# EAGLE design SharkBait_328 (EAGLE 7.1.0)
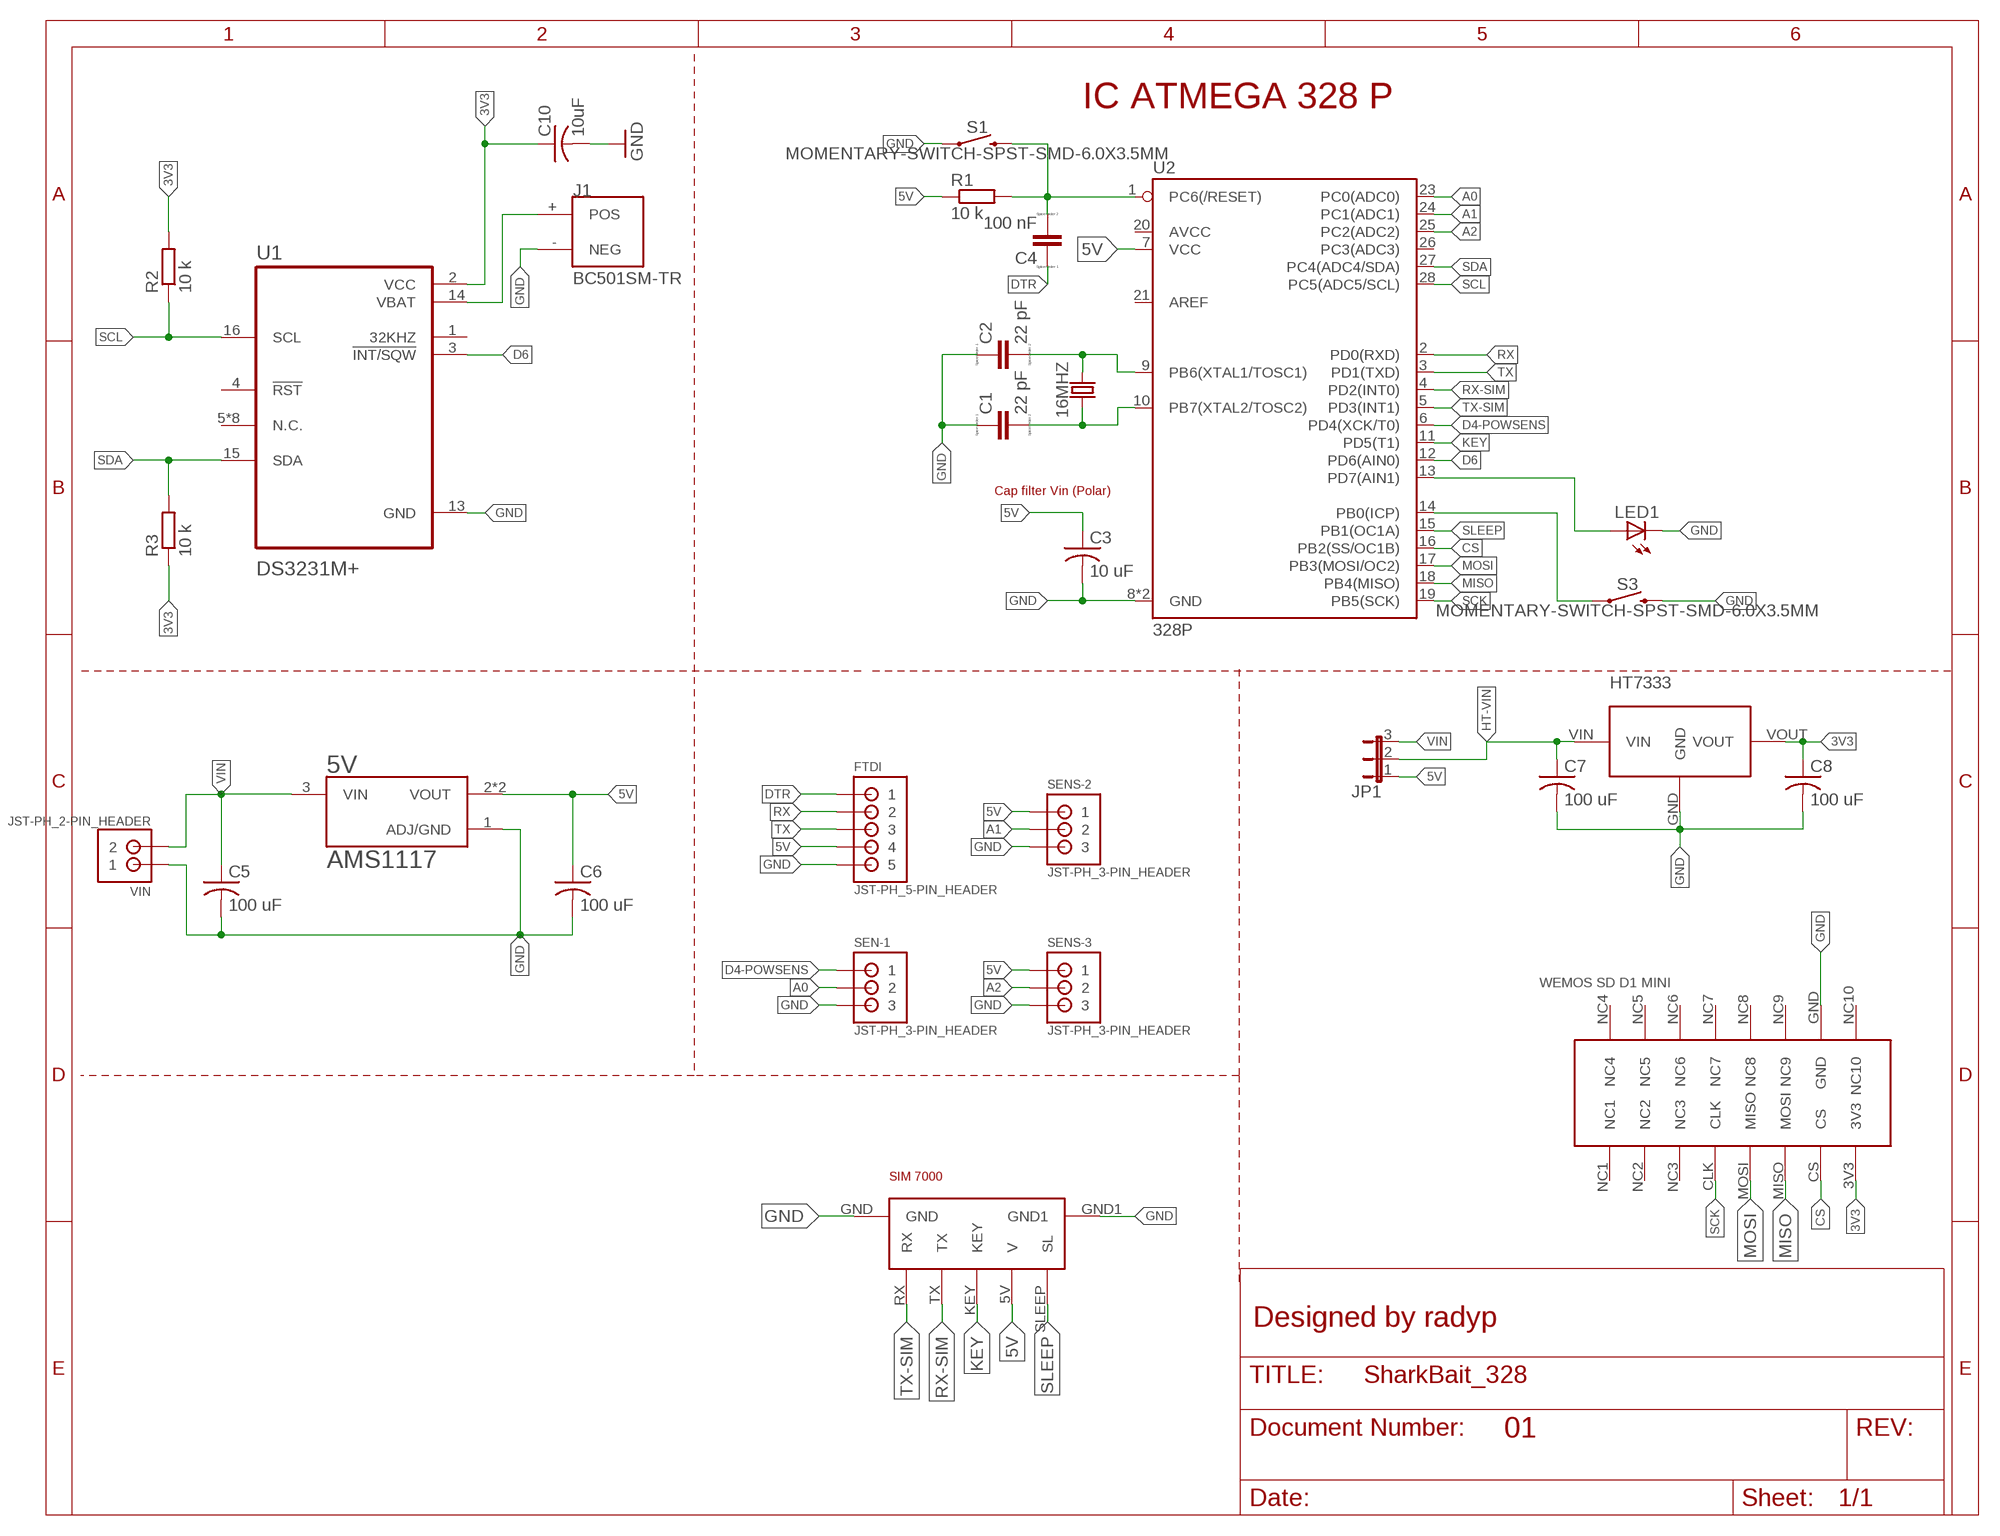
[diagram p0: schematic, sheet 1]

## Parts
5V  AMS1117  [SOT229P700X180-4N]
16MHZ  CRYSTALPTH-HC49US  [HC49US]
C1  22 pF  C  [C0805]
C2  22 pF  C  [C0805]
C3  10 uF  C-USC1206  [C1206]
C4  100 nF  C  [C0805]
C5  100 uF  C-USC1206  [C1206]
C6  100 uF  C-USC1206  [C1206]
C7  100 uF  C-USC1206  [C1206]
C8  100 uF  C-USC1206  [C1206]
C10  10uF  CAPACITOR-SMD-0805  [SMD-0805]
FTDI  JST-PH_5-PIN_HEADER  [JST_B5B-PH_HEADER]
HT7333  HT7333  [SOT89]
J1  BC501SM-TR  [MPD_BC501SM-TR]
JP1  JP2E  [JP2]
LED1  LEDCHIP-LED0805  [CHIP-LED0805]
R1  10 k  R-EU_M0805  [M0805]
R2  10 k  R-EU_M0805  [M0805]
R3  10 k  R-EU_M0805  [M0805]
S1  MOMENTARY-SWITCH-SPST-SMD-6.0X3.5MM  [TACTILE_SWITCH_SMD_6.0X3.5MM]
S3  MOMENTARY-SWITCH-SPST-SMD-6.0X3.5MM  [TACTILE_SWITCH_SMD_6.0X3.5MM]
SEN-1  JST-PH_3-PIN_HEADER  [JST_B3B-PH_HEADER]
SENS-2  JST-PH_3-PIN_HEADER  [JST_B3B-PH_HEADER]
SENS-3  JST-PH_3-PIN_HEADER  [JST_B3B-PH_HEADER]
U1  DS3231M+  [SOIC127P1032X265-16N]
U2  328P  ATMEGA328P_PDIP  [DIP28]
U$1  WEMOS_SD_D1_MINI  [WEMOS_SD_D1_MINI]
U$2  SIM7000  [SIM_7000]
VIN  JST-PH_2-PIN_HEADER  [JST_B2B-PH_HEADER]

## Nets
3V3: C8.1 C10.1 HT7333.VOUT R2.2 R3.1 U1.2(VCC) U$1.3V3
5V: 5V.2(VOUT) 5V.4(VOUT) C3.1 C6.1 FTDI.P4 JP1.1 R1.1 SENS-2.P1 SENS-3.P1 U2.7(VCC) U$2.5V(V)
A0: SEN-1.P2 U2.23(PC0(ADC0))
A1: SENS-2.P2 U2.24(PC1(ADC1))
A2: SENS-3.P2 U2.25(PC2(ADC2))
CS: U2.16(PB2(SS/OC1B)) U$1.CS
D4-POWSENS: SEN-1.P1 U2.6(PD4(XCK/T0))
D6: U1.3(!INT/SQW) U2.12(PD6(AIN0))
DTR: C4.1 FTDI.P1
GND: 5V.1(ADJ/GND) C1.1 C2.1 C3.2 C5.2 C6.2 C7.2 C8.2 C10.2 FTDI.P5 HT7333.GND J1.-(NEG) LED1.C S1.1 S3.2 SEN-1.P3 SENS-2.P3 SENS-3.P3 U1.13(GND) U2.8(GND) U2.22(GND) U$1.GND U$2.GND U$2.GND1 VIN.P1
HT-VIN: C7.1 HT7333.VIN JP1.2
KEY: U2.11(PD5(T1)) U$2.KEY
MISO: U2.18(PB4(MISO)) U$1.MISO(MOSI)
MOSI: U2.17(PB3(MOSI/OC2)) U$1.MOSI(MISO)
N$1: 16MHZ.2 C2.2 U2.9(PB6(XTAL1/TOSC1))
N$2: 16MHZ.1 C1.2 U2.10(PB7(XTAL2/TOSC2))
N$4: J1.+(POS) U1.14(VBAT)
N$5: LED1.A U2.13(PD7(AIN1))
N$8: S3.1 U2.14(PB0(ICP))
N$10: C4.2 R1.2 S1.2 U2.1(PC6(/RESET))
RX: FTDI.P2 U2.2(PD0(RXD))
RX-SIM: U2.4(PD2(INT0)) U$2.TX
SCK: U2.19(PB5(SCK)) U$1.CLK
SCL: R2.1 U1.16(SCL) U2.28(PC5(ADC5/SCL))
SDA: R3.2 U1.15(SDA) U2.27(PC4(ADC4/SDA))
SLEEP: U2.15(PB1(OC1A)) U$2.SLEEP(SL)
TX: FTDI.P3 U2.3(PD1(TXD))
TX-SIM: U2.5(PD3(INT1)) U$2.RX
VIN: 5V.3(VIN) C5.1 JP1.3 VIN.P2
Unconnected: U1.1(32KHZ) U1.4(!RST) U1.5(N.C.) U1.6(N.C.) U1.7(N.C.) U1.8(N.C.) U1.9(N.C.) U1.10(N.C.) U1.11(N.C.) U1.12(N.C.) U2.20(AVCC) U2.21(AREF) U2.26(PC3(ADC3)) U$1.NC1 U$1.NC2 U$1.NC3 U$1.NC4 U$1.NC5 U$1.NC6 U$1.NC7 U$1.NC8 U$1.NC9 U$1.NC10

## Notes on the sheet
- IC ATMEGA 328 P
- Cap filter Vin (Polar)
- Designed by radyp
- 01

## Library data of the parts
5V = C_AMS1117:AMS1117: Sot223/Pkg 1-Amp 5-Volt Low Drop Out Voltage Regulatator; AVAILABILITY: Unavailable; DESCRIPTION: 1A LOW DROPOUT VOLTAGE REGULATOR; MF: Seeed Technology; MP: AMS1117; PACKAGE: SOT-223 Seeed Technology; PRICE: None
16MHZ = SparkFun-Clocks:CRYSTAL: Crystals (Generic) These are passive quartz crystals, which can be used as a clock source for a microcontroller. Crystal's are two-terminal devices. They require external "load" capacitors to generate an oscillating signal.
C1 C2 C4 = eagle-ltspice:C: CAPACITOR, European symbol; SPICEMODEL: NONE; SPICEPREFIX: C
C3 C5-C8 = adafruit:C-US: CAPACITOR, American symbol
C10 = Fuzzy:CAPACITOR-SMD-0805
FTDI = srg:JST-PH_5-PIN_HEADER: 5-pin JST PH Shrouded Header, top entry P/N B5B-PH-K-S Mating connector PHR-5 Mating cable assembly: Sparkfun PRT-09917 <http://www.sparkfun.com/products/9917>
HT7333 = C_HT7333_SOT89:HT7333
J1 = C_BC501SM-TR:BC501SM-TR: Holder Coin Cell For Cr1220 Smd; AVAILABILITY: Unavailable; DESCRIPTION: Holder Coin Cell For Cr1220 Smd; MF: MPD _Memory; MP: BC501SM-TR; PACKAGE: DFN-8 MPD; PRICE: None
JP1 = jumper:JP2E: JUMPER
LED1 = adafruit:LED: LED OSRAM: - CHIPLED LG R971, LG N971, LY N971, LG Q971, LY Q971, LO R971, LY R971 LH N974, LH R974 LS Q976, LO Q976, LY Q976 LO Q996 - Hyper CHIPLED LW Q18S LB Q993, LB Q99A, LB R99A - SideLED LS A670, LO A670, LY A670, LG A670, LP A670 LB A673, LV A673, LT A673, LW A673 LH A674 LY A675 LS A676, LA A676, LO A676, LY A676, LW A676 LS A679, LY A679, LG A679 - Hyper Micro SIDELED® LS Y876, LA Y876, LO Y876, LY Y876 LT Y87S - SmartLED LW L88C, LW L88S LB L89C, LB L89S, LG L890 LS L89K, LO L89K, LY L89K LS L896, LA L896, LO L896, LY L896 - TOPLED LS T670, LO T670, LY T670, LG T670, LP T670 LSG T670, LSP T670, LSY T670, LOP T670, LYG T670 LG T671, LOG T671, LSG T671 LB T673, LV T673, LT T673, LW T673 LH T674 LS T676, LA T676, LO T676, LY T676, LB T676, LH T676, LSB T676, LW T676 LB T67C, LV T67C, LT T67C, LS T67K, LO T67K, LY T67K, LW E67C LS E67B, LA E67B, LO E67B, LY E67B, LB E67C, LV E67C, LT E67C LW T67C LS T679, LY T679, LG T679 LS T770, LO T770, LY T770, LG T770, LP T770 LB T773, LV T773, LT T773, LW T773 LH T774 LS E675, LA E675, LY E675, LS T675 LS T776, LA T776, LO T776, LY T776, LB T776 LHGB T686 LT T68C, LB T68C - Hyper Mini TOPLED® LB M676 - Mini TOPLED Santana® LG M470 LS M47K, LO M47K, LY M47K Source: http://www.osram.convergy.de/
R1-R3 = resistor:R-EU_: RESISTOR, European symbol
S1 S3 = SparkFun-Switches:MOMENTARY-SWITCH-SPST: Momentary Switch (Pushbutton) - SPST Normally-open (NO) SPST momentary switches (buttons, pushbuttons). Variants PTH-12MM - 12mm square, through-hole Momentary Pushbutton Switch - 12mm Square <https://www.sparkfun.com/products/9190> (COM-09190) PTH-6.0MM, PTH-6.0MM-KIT - 6.0mm square, through-hole Mini Pushbutton Switch <https://www.sparkfun.com/products/97> (COM-00097) KIT package intended for soldering kit's - only one side of pads' copper is exposed. PTH-RIGHT-ANGLE-KIT - Right-angle, through-hole Right Angle Tactile Button <https://www.sparkfun.com/products/10791> - Used on SparkFun BigTime Watch Kit <https://www.sparkfun.com/products/11734> SMD-12MM - 12mm square, surface-mount Tactile Button - SMD (12mm) <https://www.sparkfun.com/products/12993> (COM-12993) Used on SparkFun PicoBoard <https://www.sparkfun.com/products/11888> SMD-4.5MM - 4.5mm Square Trackball Switch Used on SparkFun Blackberry Trackballer Breakout <https://www.sparkfun.com/products/13169> SMD-4.6MMX2.8MM - 4.60mm x 2.80mm, surface mount Used on SparkFun SAMD21 Mini Breakout <https://www.sparkfun.com/products/13664> SMD-5.2MM, SMD-5.2-REDUNDANT - 5.2mm square, surface-mount Mini Pushbutton Switch - SMD <https://www.sparkfun.com/products/8720> (COM-08720) Used on Arduino Pro Mini <https://www.sparkfun.com/products/11114> REDUNDANT package connects both switch circuits together SMD-6.0X3.5MM - 6.0 x 3.5mm, surface mount Momentary Reset Switch SMD <https://www.sparkfun.com/products/8229> (COM-08229) SMD-6.2MM-TALL - 6.2mm square, surface mount Tactile Button - SMD (6mm) <https://www.sparkfun.com/products/12992> Used on SparkFun Digital Sandbox <https://www.sparkfun.com/products/12651> SMD-RIGHT-ANGLE - Right-angle, surface mount Used on SparkFun Block for Intel® Edison - Arduino <https://www.sparkfun.com/products/13036>; PROD_ID: SWCH-00815; SF_SKU: COM-08229
SEN-1 SENS-2 SENS-3 = srg:JST-PH_3-PIN_HEADER: 3-pin JST PH Shrouded Header, top entry P/N B3B-PH-K-S Mating connector PHR-3
U1 = C_DS3231M_:DS3231M+; DESCRIPTION: Ic Real Time Clock I2c 16soic - Ds3231m+; DIGI-KEY_PART_NUMBER: DS3231M+-ND; DIGI-KEY_PURCHASE_URL: https://www.digikey.co.id/product-detail/en/maxim-integrated/DS3231M-/DS3231M--ND/2402420?utm_source=snapeda&utm_medium=aggregator&utm_campaign=symbol; MF: Maxim Integrated; MP: DS3231M+; PACKAGE: SOIC-16 Maxim
U2 = SparkFun-IC-Microcontroller:ATMEGA328P_PDIP: Atmel 328P Through hole ATMEGA328P uC used in the Arduino 32kb flash, 1k EEPROM, 2k SRAM Datasheet <http://www.sparkfun.com/datasheets/Components/SMD/ATMega328.pdf> SparkFun Products Storefront component: AVR 28 Pin 20MHz 32K 6A/D - ATMega328P <https://www.sparkfun.com/products/9061> (COM-09061) SparkFun Simon Says - Through-Hole Soldering Kit <https://www.sparkfun.com/products/10547> (KIT-10547) SparkFun Learn to Solder - Simon Says <https://www.sparkfun.com/products/13708> (KIT-13708) SparkFun BigTime Watch Kit <https://www.sparkfun.com/products/11734> (KIT-11734) SparkFun ClockIt <https://www.sparkfun.com/products/10930> (KIT-10930) SparkFun Serial Enabled LCD Kit <https://www.sparkfun.com/products/10097> (LCD-10097) SparkFun Simon Tilts - Through Hole Soldering Kit <https://www.sparkfun.com/products/12634> (KIT-12634) SparkFun Frequency Counter Kit <https://www.sparkfun.com/products/10140> (KIT-10140) FabFM Radio Kit <https://www.sparkfun.com/products/11043> (KIT-11043) SparkFun Binary Blaster Kit <https://www.sparkfun.com/products/12037> (KIT-12037) SparkFun Metro-Gnome <https://www.sparkfun.com/products/9236> (KIT-09236) ATmega328 with Arduino Optiboot (Uno) <https://www.sparkfun.com/products/10524> (DEV-10524); PROD_ID: IC-09136
U$1 = C_WEMOS_SD_D1_MINI:WEMOS_SD_D1_MINI
U$2 = C_SIM7000:SIM7000
VIN = srg:JST-PH_2-PIN_HEADER: 2-pin JST PH Shrouded Header, top entry P/N B2B-PH-K-S Mating connector PHR-2 Mating cable assembly: Sparkfun PRT-09914 <http://www.sparkfun.com/products/9914>

## Board
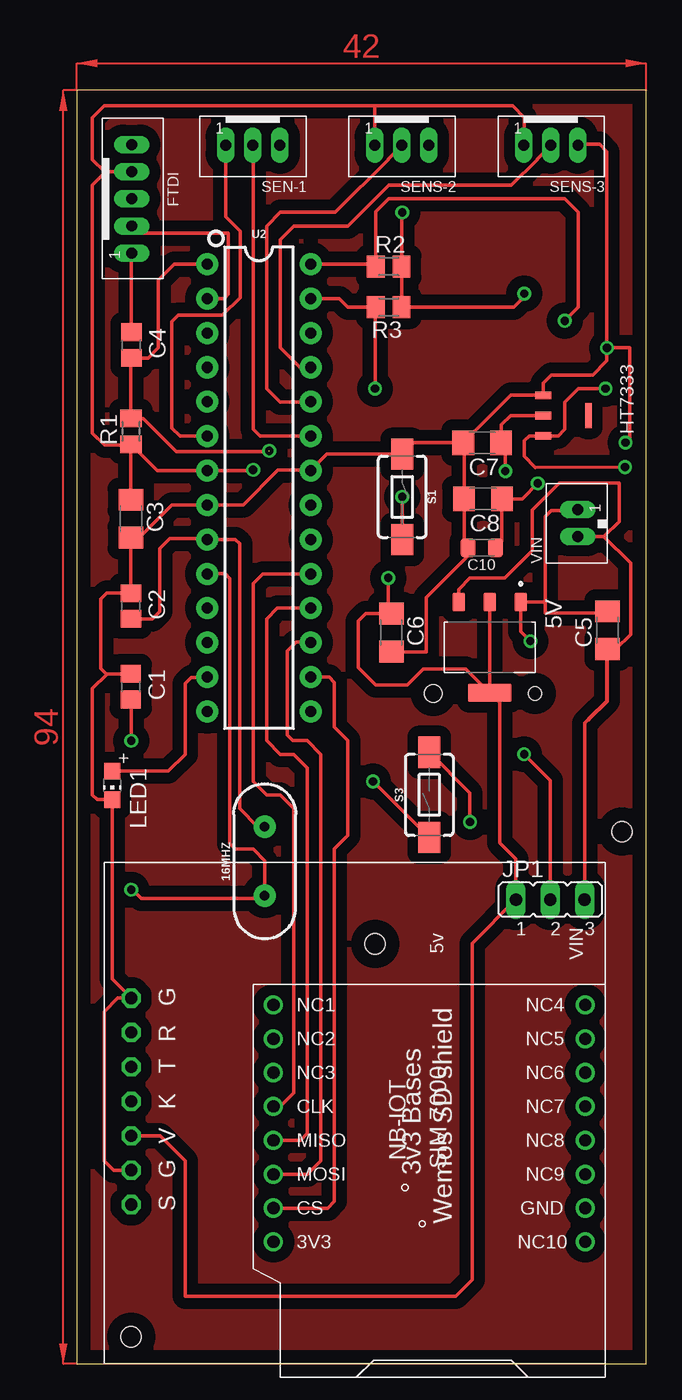
[diagram p1: board, top side]
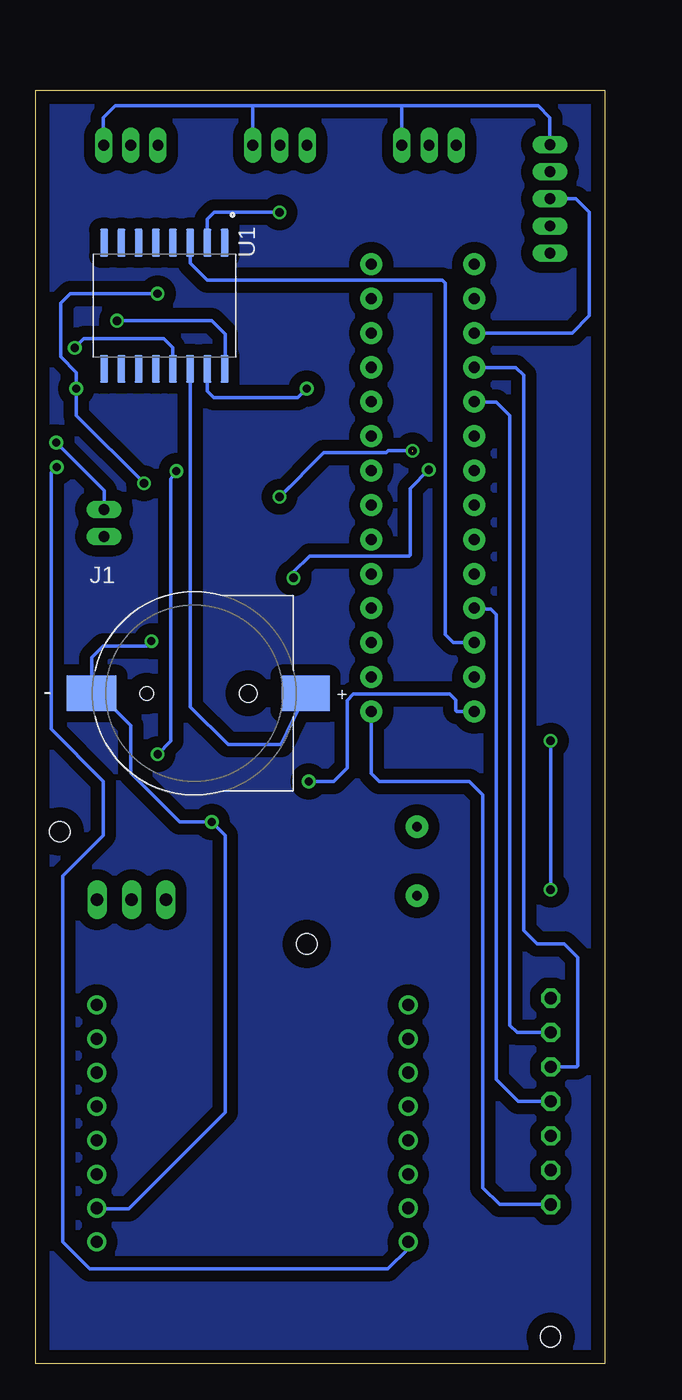
[diagram p2: board, bottom side, seen from below]

Size 42 x 94 mm. Coordinates in mm from the lower left corner, seen from the top.
Outline: 0,0 42,0 42,94 0,94 0,0
Copper layers (1*16): Top 0.035mm / dielectric 1.5mm / Bottom 0.035mm
Design rules "default": minimum track width 10mil, minimum drill 24mil, track to track 8mil, track to pad 8mil, pad to pad 8mil, via to via 8mil, smd to smd 8mil, copper to edge 40mil, drill to drill 8mil, minimum pad ring 10mil, minimum via ring 8mil, stop-mask expansion 4mil, vias tented up to drill 0mil, thermal gap 10mil
Holes 1.5 mm at 40.22,39.29 4,2 22,31

### Footprints (pad centres in the part's own frame; a part is rotated, then mirrored left to right if it is on the bottom)
SOT229P700X180-4N = smd 1.31 x 0.93: 1 -3.345,2.29; 2 -3.345,0; 3 -3.345,-2.29 | smd 1.31 x 3.24: 4 3.345,0
HC49US = drill 0.7 pad 1.651: 1 -2.54,0; 2 2.54,0
C0805 = smd 1.3 x 1.5: 1 -0.95,0; 2 0.95,0
C1206 = smd 1.6 x 1.8: 1 -1.4,0; 2 1.4,0
SMD-0805 = smd 1.1 x 1.4: 1 -1,0; 2 1,0
JST_B5B-PH_HEADER = drill 0.8 long: P1 4,0.048; P2 2,0.048; P3 0,0.048; P4 -2,0.048; P5 -4,0.048
SOT89 = smd 0.559 x 1.194: GND -1.499,-0.597; VIN 0,-0.597; VOUT 1.499,-0.597 | smd 1.829 x 0.457: P$4 0,2.743
MPD_BC501SM-TR = smd 3.54 x 2.6: + 8.23,0 | smd 3.66 x 2.6: - -7.57,0 | hole 1: -3.5,0 | hole 1.3: 4,0
JP2 = drill 0.914 long: 1 -2.54,0; 2 0,0; 3 2.54,0
CHIP-LED0805 = smd 1.2 x 1.2: A 0,-1.05; C 0,1.05
M0805 = smd 1.3 x 1.6: 1 -0.95,0; 2 0.95,0
TACTILE_SWITCH_SMD_6.0X3.5MM = smd 2.3 x 1.6: 1 -3.15,0; 2 3.15,0
JST_B3B-PH_HEADER = drill 0.8 long: P1 2.027,0.048; P2 0.028,0.048; P3 -1.972,0.048
SOIC127P1032X265-16N = smd 2.05 x 0.59: 1 -4.655,4.445; 2 -4.655,3.175; 3 -4.655,1.905; 4 -4.655,0.635; 5 -4.655,-0.635; 6 -4.655,-1.905; 7 -4.655,-3.175; 8 -4.655,-4.445; 9 4.655,-4.445; 10 4.655,-3.175; 11 4.655,-1.905; 12 4.655,-0.635; 13 4.655,0.635; 14 4.655,1.905; 15 4.655,3.175; 16 4.655,4.445
DIP28 = drill 0.813 pad 1.626: 1 -16.51,-3.81; 2 -13.97,-3.81; 3 -11.43,-3.81; 4 -8.89,-3.81; 5 -6.35,-3.81; 6 -3.81,-3.81; 7 -1.27,-3.81; 8 1.27,-3.81; 9 3.81,-3.81; 10 6.35,-3.81; 11 8.89,-3.81; 12 11.43,-3.81; 13 13.97,-3.81; 14 16.51,-3.81; 15 16.51,3.81; 16 13.97,3.81; 17 11.43,3.81; 18 8.89,3.81; 19 6.35,3.81; 20 3.81,3.81; 21 1.27,3.81; 22 -1.27,3.81; 23 -3.81,3.81; 24 -6.35,3.81; 25 -8.89,3.81; 26 -11.43,3.81; 27 -13.97,3.81; 28 -16.51,3.81
WEMOS_SD_D1_MINI = drill 0.9: 3V3 1.5,10; CLK 1.5,20; CS 1.5,12.5; GND 24.5,12.5; MISO 1.5,17.5; MOSI 1.5,15; NC1 1.5,27.5; NC2 1.5,25; NC3 1.5,22.5; NC4 24.5,27.5; NC5 24.5,25; NC6 24.5,22.5; NC7 24.5,20; NC8 24.5,17.5; NC9 24.5,15; NC10 24.5,10
SIM_7000 = drill 0.9 octagon: 5V 20.16,2; GND 10,2; GND1 22.7,2; KEY 17.62,2; RX 12.54,2; SLEEP 25.24,2; TX 15.08,2
JST_B2B-PH_HEADER = drill 0.8 long: P1 1.075,0.048; P2 -0.925,0.048

### Placement (x,y rotation side)
5V  30.46,52.89 270 top
16MHZ  13.86,37.11 90 top
C1  3.97,49.99 270 top
C2  3.98,55.94 270 top
C3  3.98,62.39 270 top
C4  4.02,75.21 270 top
C5  39.16,54.16 90 top
C6  23.2,53.98 270 top
C7  29.9,68 180 top
C8  29.96,63.84 180 top
C10  29.87,60.25 180 top
FTDI  4,86 270 top
HT7333  35,70 270 top
J1  30.3,49.5 0 bottom
JP1  34.92,34.27 0 top
LED1  2.6,42.7 180 top
R1  3.98,68.84 90 top
R2  23,81 0 top
R3  23,78 180 top
S1  24,64 270 top
S3  26,42 90 top
SEN-1  13,90 180 top
SENS-2  24,90 180 top
SENS-3  35,90 180 top
U1  32.5,78.1 270 bottom
U2  13.43,64.67 270 top
U$1  13,-1 0 top
U$2  2,37 270 top
VIN  37,62 90 top

### Tracks (layer width: path | path; a pad name or v marks a point on that pad's centre or on a via)
3V3  (via drill 0.6, 0.61)
  Top 0.254: v24,85 23.95,84.95 R2.2 R3.1 32.22,78 33.08,78.86 33.08,78.92 v33,79 | v39,72 37,72 36,71 36,69 35.5,68.5 HT7333.VOUT 33.36,68.5 33.02,68.15 33.02,68.11 33,68.09 33,67 33.84,66.16 v40.44,66.2 | C10.1 31.36,60.74 C8.1 32.84,63.84 v34,65
  Bottom 0.254: v24,85 28.82,85 29.32,84.5 U1.2 | v33,79 39.44,79 40.16,78.28 40.16,74.34 39,73.18 v39,72 39,70 v34,65 | U$1.3V3 14.5,8.5 16,7 38,7 40,9 40,36 37,39 37,43 40.86,46.86 40.86,65.79 v40.44,66.2
5V  (via drill 0.61)
  Top 0.254: 22,92.86 2,92.86 1.14,92 1.14,88.9 2.04,88 FTDI.P4 2.14,88 1.14,87 1.14,68.7 2.04,67.8 3.89,67.8 R1.1 | 22,92.86 32.14,92.86 33,92 33,89.98 SENS-3.P1 | SENS-2.P1 21.97,92.83 22,92.86 | R1.1 C3.1 | R1.1 5.93,65.94 U2.7 12.94,65.94 v13,66 | v22.97,58.02 22.97,55.37 22.72,55.12 22.93,55.12 C6.1 21.31,55.38 20.75,54.82 20.75,51.39 22.04,50.1 24.36,50.1 25.56,51.29 28.68,51.29 30.44,49.53 5V.4 | U$2.5V 6.16,16.84 8,15 8,5 27.96,5 29.16,6.2 29.16,31.04 JP1.1 32.39,37.27 31.19,38.47 31.19,48.81 5V.4 | 5V.2 5V.4
  Bottom 0.254: 23,58.05 v22.98,58.02 | v22.98,58.02 v22.97,58.02 | v13,66 14.37,64.63 14.37,59.7 14.43,59.64 21.79,59.64 22.98,58.45 v22.98,58.02
A0
  Top 0.254: SEN-1.P2 13,89.92 13,69 13.52,68.48 U2.23
A1
  Top 0.254: SENS-2.P2 22.96,88.94 22.96,88.89 19.07,85 15,85 14,84 14,72 15,71 17.22,71 U2.24
A2
  Top 0.254: SENS-3.P2 33.96,88.94 33.96,88.89 32.07,87 23,87 20,84 16,84 15,83 15,75 16.44,73.56 U2.25
CS
  Top 0.254: U$1.CS 18.5,11.5 19,12 19,38 20,39 20,46 19,47 19,50.31 18.6,50.71 17.25,50.71 U2.16
D4-POWSENS
  Top 0.254: SEN-1.P1 10.97,84.67 12.03,83.61 12.03,78.72 10.74,77.42 7.49,77.42 7,76.94 7,69.09 7.61,68.48 U2.6
D6
  Bottom 0.254: U1.3 30.59,81.25 29.34,80 12,80 11.77,79.77 11.77,53.82 11.19,53.24 U2.12
DTR
  Top 0.254: FTDI.P1 4.02,81.97 C4.1
GND  (via drill 0.6, 0.61)
  Top 0.254: C7.2 32,71.5 HT7333.GND 34.4,72.4 35,73 38.05,73 39.11,74.06 v39.11,75 | SENS-3.P3 37.06,90.04 38.56,90.04 39.11,89.5 v39.11,75 | C5.2 39.03,55.44 34.55,55.44 34.55,56.23 | 34.55,56.23 5V.1 32.75,54.07 v33.46,53.35 | VIN.P1 36.88,63 35,63 34.55,62.55 34.55,56.23 | C7.2 24.85,68 S1.1 18.45,67.15 U2.22 17.22,65.96 14.83,65.96 12.27,63.4 U2.8 6.99,63.4 4.58,60.99 C3.2 C2.1 2.19,56.89 1.74,56.44 1.74,51.35 2.16,50.93 C1.1 2.22,50.94 1.14,49.86 1.14,42 1.49,41.65 LED1.C 2.6,28.4 U$2.GND 3,27 2,26 2,15 2.7,14.3 U$2.GND1 | C6.2 23.24,52.54 25.78,52.54 25.78,56.58 28.87,59.68 C10.2 28.56,60.56 C8.2 28.56,67.94 C7.2 | v39.11,75 40.78,75 40.78,68.31 v40.48,68 | S3.2 29,42.15 v29,40
  Bottom 0.254: FTDI.P5 4.05,92 4.91,92.86 15,92.86 | 15,92.86 26,92.86 | 26,92.86 36.14,92.86 37,92 37,89.98 SENS-3.P3 | SEN-1.P3 14.97,92.83 15,92.86 | SENS-2.P3 25.97,92.83 26,92.86 | U1.13 31.86,75 32.54,75.67 38.43,75.67 v39.11,75 | v40.48,68 36.95,64.48 VIN.P1 | J1.- 37.87,50 | 37.87,50 37.87,52.13 37,53 33.81,53 v33.46,53.35 | U$1.GND 37.44,11.44 35.12,11.44 28,18.56 28,39 v29,40 31.37,40 35,43.63 35,47.13 37.87,50
HT-VIN  (via drill 0.6)
  Top 0.254: C7.1 31.3,69.32 32,70.01 34.39,70.01 HT7333.VIN | 31.36,67.94 C7.1 | v31.61,65.9 31.61,67.69 C7.1 | v33,45 34.92,43.08 JP1.2
  Bottom 0.254: v31.61,65.9 32.03,65.32 32.03,45.97 v33,45
KEY
  Bottom 0.254: U$2.KEY 6.38,19.38 8,21 8,55.33 8.4,55.73 9.57,55.73 U2.11
MISO
  Top 0.254: U$1.MISO 16.5,16.5 17,17 17,44 16,45 15,45 14,46 14,54.98 14.79,55.78 U2.18
MOSI
  Top 0.254: U$1.MOSI 17,14 18,15 18,45 17,46 15.93,46 15.52,46.41 15.52,52.63 16.17,53.28 17.2,53.28 U2.17
N$1
  Top 0.254: C2.2 5.55,54.99 6.09,55.53 6.09,60.17 6.84,60.92 9.56,60.92 U2.9 11.69,60.86 12,60.54 12,41 13.35,39.65 16MHZ.2
N$2  (via drill 0.61)
  Top 0.254: C1.2 4,49.01 v4,46 | v4,35 4.08,35 4.74,34.34 13.63,34.34 16MHZ.1 13.86,37.14 13,38 11.7,38 11.29,38.41 11.29,57.98 10.95,58.32 U2.10
  Bottom 0.254: v4,46 v4,35
N$3
  pour Top (isolate 0.813): 0,0 42,0 42,94 0,94
N$4
  Bottom 0.254: U1.14 30.59,48.5 27.8,45.71 23.86,45.71 J1.+
N$5
  Top 0.254: LED1.A 6.75,43.75 8,45 8,50.22 8.44,50.66 9.58,50.66 U2.13
N$6
  pour Bottom (isolate 0.813): 0,0 42,0 42,94 0,94
N$8  (via drill 0.61)
  Top 0.254: S3.1 v21.85,43
  Bottom 0.254: v21.85,43 20,43 19,44 19,48.98 18.55,49.44 11.44,49.44 11,49 11,48.22 10.94,48.16 U2.14
N$10  (via drill 0.61)  (1 unrouted)
  Top 0.254: U2.1 7.18,81.18 6,80 6,75 5.26,74.26 C4.2 3.98,74.22 R1.2 4.88,69.79 7.34,67.34 10.09,67.34 10.11,67.36 14.19,67.36 | v24,64 S1.2
  Bottom 0.254: 23.28,64.72 v24,64 20.75,67.25 16.13,67.25 15.98,67.41 v14.19,67.41
RX
  Top 0.254: FTDI.P2 4.6,83.45 11.17,83.45 11.17,78.95 10.86,78.64 U2.2
RX-SIM
  Bottom 0.254: U$2.TX 2.08,21.92 2,22 2,30 3,31 5,31 6,32 6,73 6.56,73.56 U2.4
SCK
  Top 0.254: U$1.CLK 15,19 16,20 16,41 15,42 14,42 13,43 13,57.6 13.71,58.3 17.22,58.3 U2.19
SCL  (via drill 0.61)
  Top 0.254: U2.28 21.87,81.18 R2.1 22.05,85.05 23,86 36,86 37,85 37,78 v36,77
  Bottom 0.254: v36,77 29,77 28,76 28,73.5 U1.16
SDA  (via drill 0.61)
  Top 0.254: U2.27 19.36,78.64 20,78 R3.2 22,77.95 v22,72
  Bottom 0.254: U1.15 29.32,71.8 28.85,71.33 22.67,71.33 v22,72
SLEEP
  Bottom 0.254: U$2.SLEEP 7.76,11.76 9,13 9,42 10,43 16.66,43 17.23,43.58 U2.15
TX
  Bottom 0.254: FTDI.P3 2.14,86 1.14,85 1.14,77.38 2.42,76.1 U2.3
TX-SIM
  Bottom 0.254: U$2.RX 6.46,24.46 7,25 7,70 8,71 9.6,71 U2.5
VIN
  Top 0.254: VIN.P2 38.89,61.08 | 38.89,61.08 40.86,59.1 40.86,53.86 39.76,52.76 C5.1 | 38.89,61.08 40,62.19 40,65 35.57,65 33.6,63.03 33.6,62 33.6,61.67 33.6,60.05 31.56,58 29,58 28.17,57.17 5V.3 | 37.73,47.56 37.47,47.29 JP1.3
  Top 0.305: 37.73,47.56 39.11,48.94 39.11,52.72 C5.1
(copper drawn outside any net)
  shapes: Top area x2

### Text on the board
tPlace: 5v | VIN